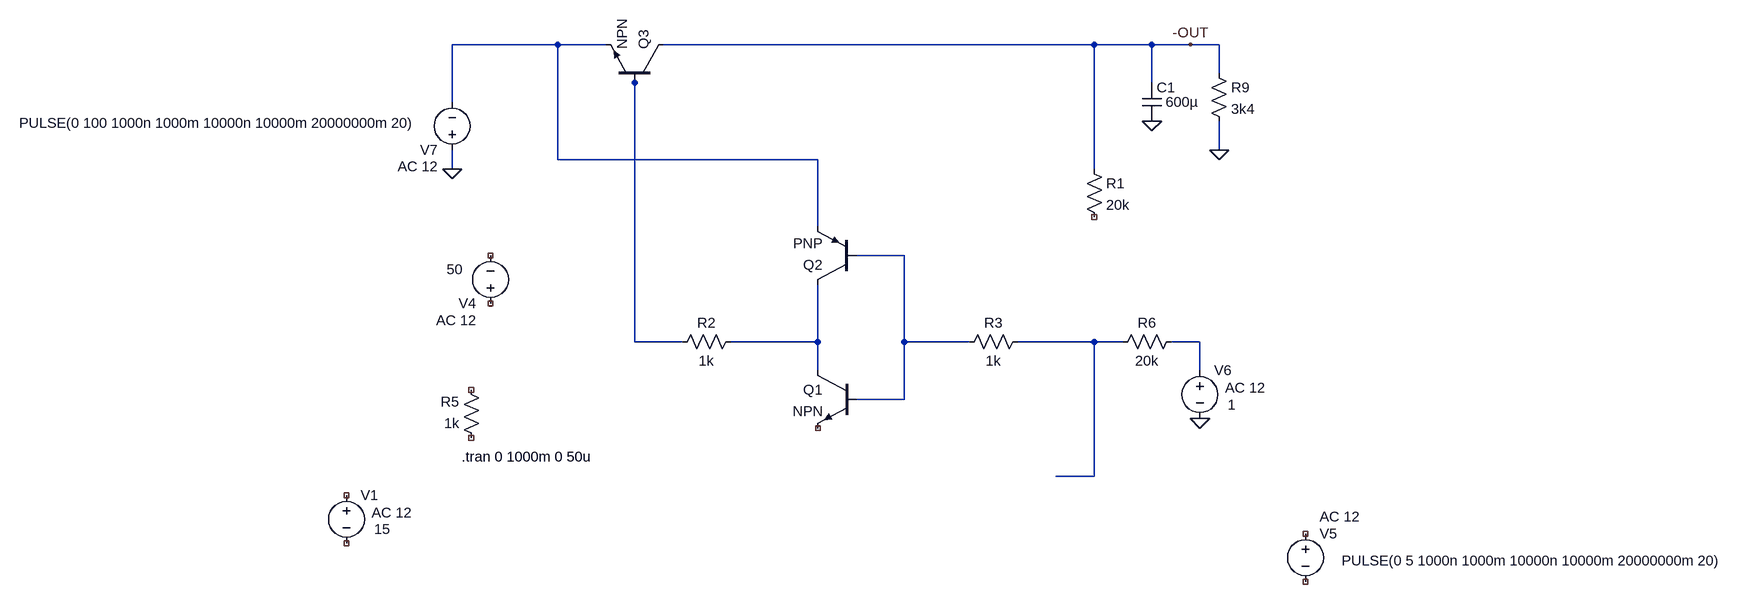
[diagram p0: schematic HV_Reg_Negative 4.asc]
HV_Reg_Negative 4.asc, the LTspice schematic file:
Version 4
SHEET 1 1556 680
WIRE -912 -496 -1088 -496
WIRE -832 -496 -912 -496
WIRE 464 -496 -736 -496
WIRE 560 -496 464 -496
WIRE 624 -496 560 -496
WIRE 672 -496 624 -496
WIRE 672 -448 672 -496
WIRE -784 -432 -784 -448
WIRE 560 -432 560 -496
WIRE -1088 -400 -1088 -496
WIRE 672 -320 672 -368
WIRE -912 -304 -912 -496
WIRE 0 -304 -912 -304
WIRE -1088 -288 -1088 -320
WIRE 464 -288 464 -496
WIRE 0 -192 0 -304
WIRE 144 -144 64 -144
WIRE -784 0 -784 -432
WIRE -704 0 -784 0
WIRE 0 0 0 -96
WIRE 0 0 -624 0
WIRE 144 0 144 -144
WIRE 256 0 144 0
WIRE 464 0 336 0
WIRE 512 0 464 0
WIRE 640 0 592 0
WIRE 0 48 0 0
WIRE 640 48 640 0
WIRE 144 96 144 0
WIRE 144 96 64 96
WIRE 464 224 464 0
WIRE 464 224 400 224
FLAG 624 -496 -OUT
FLAG 560 -368 0
FLAG 672 -320 0
FLAG -1088 -288 0
FLAG 640 128 0
SYMBOL cap 544 -432 R0
WINDOW 3 39 32 Left 2
SYMATTR InstName C1
SYMATTR Value 600µ
SYMBOL res 656 -464 R0
SYMATTR InstName R9
SYMATTR Value 3k4
SYMBOL res 448 -304 R0
SYMATTR InstName R1
SYMATTR Value 20k
SYMBOL voltage -1024 -48 R180
WINDOW 123 24 -12 Left 2
WINDOW 39 0 0 Left 2
WINDOW 3 46 73 Left 2
SYMATTR Value2 AC 12
SYMATTR Value 50
SYMATTR InstName V4
SYMBOL res -1040 176 R180
WINDOW 0 36 76 Left 2
WINDOW 3 36 40 Left 2
SYMATTR InstName R5
SYMATTR Value 1k
SYMBOL npn -736 -432 M270
SYMATTR InstName Q3
SYMBOL voltage 816 304 R0
WINDOW 123 24 -12 Left 2
WINDOW 39 0 0 Left 2
WINDOW 3 60 61 Left 2
SYMATTR Value2 AC 12
SYMATTR Value PULSE(0 5 1000n 1000m 10000n 10000m 20000000m 20)
SYMATTR InstName V5
SYMBOL res 608 -16 R90
WINDOW 0 0 56 VBottom 2
WINDOW 3 32 56 VTop 2
SYMATTR InstName R6
SYMATTR Value 20k
SYMBOL res -720 16 R270
WINDOW 0 32 56 VTop 2
WINDOW 3 0 56 VBottom 2
SYMATTR InstName R2
SYMATTR Value 1k
SYMBOL voltage -1264 240 R0
WINDOW 123 42 45 Left 2
WINDOW 39 0 0 Left 2
WINDOW 3 46 73 Left 2
SYMATTR Value2 AC 12
SYMATTR Value 15
SYMATTR InstName V1
SYMBOL voltage 640 32 R0
WINDOW 123 42 45 Left 2
WINDOW 39 0 0 Left 2
WINDOW 3 46 73 Left 2
SYMATTR Value2 AC 12
SYMATTR Value 1
SYMATTR InstName V6
SYMBOL voltage -1088 -304 R180
WINDOW 123 24 -12 Left 2
WINDOW 39 0 0 Left 2
WINDOW 3 60 61 Left 2
SYMATTR Value2 AC 12
SYMATTR Value PULSE(0 100 1000n 1000m 10000n 10000m 20000000m 20)
SYMATTR InstName V7
SYMBOL npn 64 48 M0
SYMATTR InstName Q1
SYMBOL pnp 64 -96 R180
SYMATTR InstName Q2
SYMBOL res 240 16 R270
WINDOW 0 32 56 VTop 2
WINDOW 3 0 56 VBottom 2
SYMATTR InstName R3
SYMATTR Value 1k
TEXT -1072 192 Left 2 !.tran 0 1000m 0 50u

The netlist it stands for:
* HV_Reg_Negative 4.asc
C1 -OUT 0 600µ
R9 -OUT 0 3k4
R1 -OUT NC_01 20k
V4 NC_02 NC_03 50 AC 12
R5 NC_04 NC_05 1k
Q3 -OUT N002 N001 0 NPN
V5 NC_06 NC_07 PULSE(0 5 1000n 1000m 10000n 10000m 20000000m 20) AC 12
R6 N006 N005 20k
R2 N002 N004 1k
V1 NC_08 NC_09 15 AC 12
V6 N006 0 1 AC 12
V7 0 N001 PULSE(0 100 1000n 1000m 10000n 10000m 20000000m 20) AC 12
Q1 N004 N003 NC_10 0 NPN
Q2 N004 N003 N001 0 PNP
R3 N003 N005 1k
.model NPN NPN
.model PNP PNP
.lib standard.bjt
.tran 0 1000m 0 50u
.backanno
.end